# Altium schematic sheet [3] CAN.SchDoc
size A4; DocumentNumber: 4; SheetNumber: 4; SheetTotal: 4
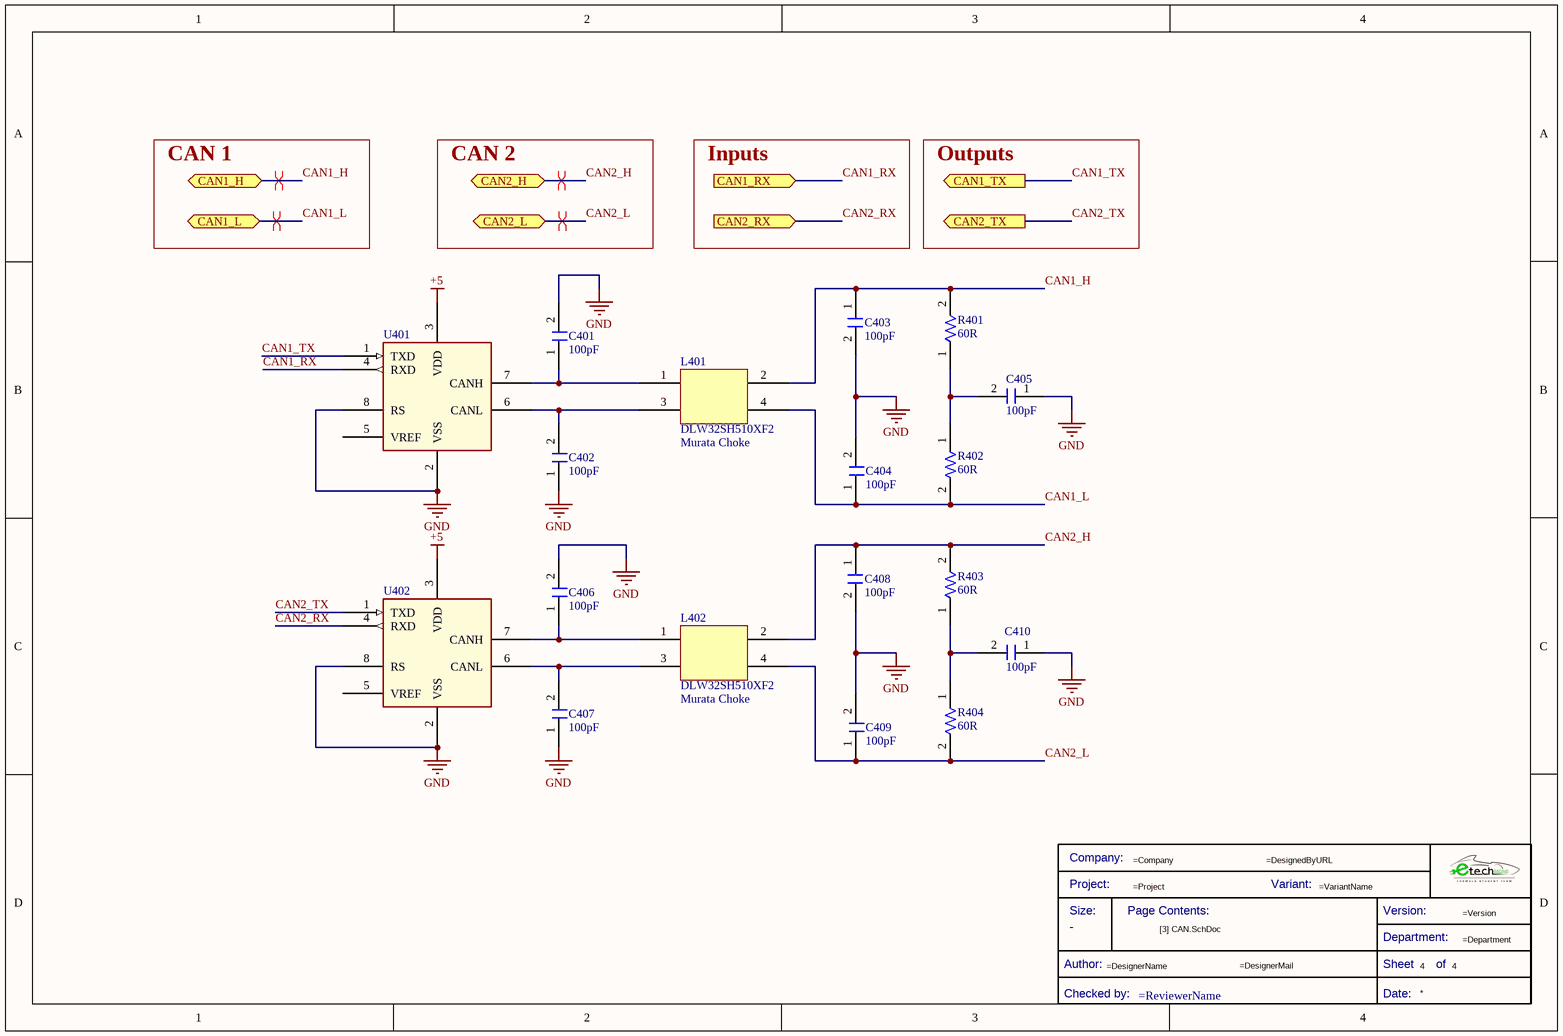
[diagram p0: [3] CAN.SchDoc]

## Parts
*?  Title Block_template  (value not drawn)  (graphical)
C401  Capacitance: 100pF  [C0805FNPC-W]  (hidden comment: 885012007057)
C402  Capacitance: 100pF  [C0805FNPC-W]  (hidden comment: 885012007057)
C403  Capacitance: 100pF  [C0805FNPC-W]  (hidden comment: 885012007057)
C404  Capacitance: 100pF  [C0805FNPC-W]  (hidden comment: 885012007057)
C405  Capacitance: 100pF  [C0805FNPC-W]  (hidden comment: 885012007057)
C406  Capacitance: 100pF  [C0805FNPC-W]  (hidden comment: 885012007057)
C407  Capacitance: 100pF  [C0805FNPC-W]  (hidden comment: 885012007057)
C408  Capacitance: 100pF  [C0805FNPC-W]  (hidden comment: 885012007057)
C409  Capacitance: 100pF  [C0805FNPC-W]  (hidden comment: 885012007057)
C410  Capacitance: 100pF  [C0805FNPC-W]  (hidden comment: 885012007057)
L401  DLW32SH510XF2
L402  DLW32SH510XF2
R401  value 60R  [R0805FTK]  (hidden comment: R60-0805FTN)
R402  value 60R  [R0805FTK]  (hidden comment: R60-0805FTN)
R403  value 60R  [R0805FTK]  (hidden comment: R60-0805FTN)
R404  value 60R  [R0805FTK]  (hidden comment: R60-0805FTN)
U401  Transceiver CAN MCP2551 I/SN  (value not drawn)
U402  Transceiver CAN MCP2551 I/SN  (value not drawn)

## Ports
CAN1_H (bidir), CAN1_L (bidir), CAN1_RX (in), CAN1_TX (out), CAN2_H (bidir), CAN2_L (bidir), CAN2_RX (in), CAN2_TX (out)

## Nets
+5: U401.3(VDD) U402.3(VDD)
GND: C401.2 C402.1 C403.2 C404.2 C405.1 C406.2 C407.1 C408.2 C409.2 C410.1 U401.2(VSS) U401.8(RS) U402.2(VSS) U402.8(RS)
CAN1_H: C403.1 L401.2 R401.2 ; port CAN1_H
CAN1_L: C404.1 L401.4 R402.2 ; port CAN1_L
CAN1_RX: U401.4(RXD) ; port CAN1_RX
CAN1_TX: U401.1(TXD) ; port CAN1_TX
CAN2_H: C408.1 L402.2 R403.2 ; port CAN2_H
CAN2_L: C409.1 L402.4 R404.2 ; port CAN2_L
CAN2_RX: U402.4(RXD) ; port CAN2_RX
CAN2_TX: U402.1(TXD) ; port CAN2_TX
NetC401_1: C401.1 L401.1 U401.7(CANH)
NetC402_2: C402.2 L401.3 U401.6(CANL)
NetC405_2: C405.2 R401.1 R402.1
NetC406_1: C406.1 L402.1 U402.7(CANH)
NetC407_2: C407.2 L402.3 U402.6(CANL)
NetC410_2: C410.2 R403.1 R404.1

Not connected (* = marked no-connect by the designer): U401 5(VREF); U402 5(VREF)

## Layout directives
differential pair: CAN1_H, CAN1_L, CAN2_H, CAN2_L

## Notes on the sheet
- CAN 1
- CAN 2
- Inputs
- Outputs
- (near L401) Murata Choke
- (near L402) Murata Choke
- (in symbol Title Block_template) Company:; Project:; Variant:; Size:; Page Contents:; Version:; Department:; Author:; Sheet; of; Checked by:; Date:

## Library data of the parts
*? = Title Block_template: Standard Title Block; .Creator: GP; Category: Title Block; .PCBcheck: GP; .SCHcheck: GP; Checked by:: =ReviewerName; Size: -
C401-C410 = C100p-50V-0805FNPC-C0G/NP0: Multilayer Ceramic Capacitor, Wcap-Csgp Series, 100 Pf, 5%, C0G / Np0, 50 V, 0805 [2012 Metric] Rohs Compliant: Yes; Manufacturer: Wurth Electronics; Voltage Rating: 50V; .Creator: DR; Supplier 1: RSComponents; Manufacturer Part Number: 885012007057; RoHS: Yes; Category: Ceramic Capacitors; Stock 1: 1; Pricing 1: 4000=0,03900, 12000=0,03800 (USD); Mount: Surface Mount; Case/Package: 0805; Case Code (Metric): 2012; Case Code (Imperial): 0805; Min Operating Temperature: -55°C; Max Operating Temperature: 125°C; Packaging: Cut Tape; Dielectric: C0G; Tolerance: 5%; Voltage Rating (DC): 50V; Length: 0.079inch; Width: 0.049inch; Thickness: 0.035inch; REACH SVHC: Unknown; RoHS Compliant: Yes; ComponentLink1URL: http://www.farnell.com/datasheets/1958443.pdf?src-supplier=Farnell; ComponentLink1Description: http://www.farnell.com/datasheets/1958443.pdf?src-supplier=Farnell; ComponentLink2URL: https://katalog.we-online.de/pbs/datasheet/885012007057.pdf?src-supplier=Digi-Key; ComponentLink2Description: https://katalog.we-online.de/pbs/datasheet/885012007057.pdf?src-supplier=Digi-Key; ComponentLink3URL: http://www.farnell.com/datasheets/1958443.pdf?src-supplier=Element14; ComponentLink3Description: http://www.farnell.com/datasheets/1958443.pdf?src-supplier=Element14; ComponentLink4URL: http://www.farnell.com/datasheets/1958443.pdf?src-supplier=Newark; ComponentLink4Description: http://www.farnell.com/datasheets/1958443.pdf?src-supplier=Newark; ComponentLink5Description: Where buy it; ComponentLink5URL: https://www.we-online.com/catalog/en/WCAP-CSGP-50VDC#885012007057; Supplier Part Number 1: 1813930
L401 L402 = Choke Murata
R401-R404 = R60-0805FTN: Res Thin Film 0805 60.4 Ohm 0.1% 1/8W ±25ppm/°C Molded SMD SMD Punched Carrier T/R; Manufacturer 1: Panasonic; Manufacturer Part Number 1: ERA-6AEB60R4V; Resistance: 60.4R; Voltage Rating (DC): 100V; Max Power Dissipation: 125mW; Voltage Rating: 200V; .Creator: DR; Supplier 1: Arrow Electronics; RoHS: Yes; Category: Chip SMD Resistors; Stock 1: 5000; Pricing 1: 1=0,04650, 10=0,03900, 100=0,02860 (USD); Mount: Surface Mount; Case/Package: 0805; Number of Pins: 2; Contact Plating: Tin; Weight: 0.000194oz; Case Code (Metric): 2012; Case Code (Imperial): 0805; Min Operating Temperature: -55°C; Max Operating Temperature: 155°C; Temperature Coefficient: 25ppm/°C; Tolerance: 0.1%; Resistor Type: Thin Film,Metal Film; Features: Automotive AEC-Q200; Package Quantity: 5000; Number of Terminations: 2; Termination: SMD/SMT; Power Rating: 125mW; Packaging: Tape and Reel; Length: 2mm; Width: 1.25mm; Height: 0.5mm; Depth: 1.25mm; Radiation Hardening: No; Lead Free: Lead Free; ComponentLink1URL: https://datasheet.ciiva.com/11811/0900766b80eb1d8c-11811180.pdf?src-supplier=RSComponents; ComponentLink1Description: https://datasheet.ciiva.com/11811/0900766b80eb1d8c-11811180.pdf?src-supplier=RSComponents; ComponentLink2URL: https://datasheet.ciiva.com/41450/001181146-da-01-en-widerstand-era-0805-60r4-0-1-5000st-41450303.pdf?src-supplier=Conrad; ComponentLink2Description: https://datasheet.ciiva.com/41450/001181146-da-01-en-widerstand-era-0805-60r4-0-1-5000st-41450303.pdf?src-supplier=Conrad; ComponentLink3URL: https://datasheet.ciiva.com/5951/485442-5951173.pdf?src-supplier=Farnell; ComponentLink3Description: https://datasheet.ciiva.com/5951/485442-5951173.pdf?src-supplier=Farnell; ComponentLink4URL: https://datasheet.ciiva.com/30184/54aoa0000ce26-30184022.pdf?src-supplier=Onlinecomponents.com; ComponentLink4Description: https://datasheet.ciiva.com/30184/54aoa0000ce26-30184022.pdf?src-supplier=Onlinecomponents.com; ComponentLink5URL: https://datasheet.ciiva.com/9188/aoa0000ce26-9188476.pdf?src-supplier=Avnet; ComponentLink5Description: https://datasheet.ciiva.com/9188/aoa0000ce26-9188476.pdf?src-supplier=Avnet; Supplier Part Number 1: ERA-6AEB60R4V